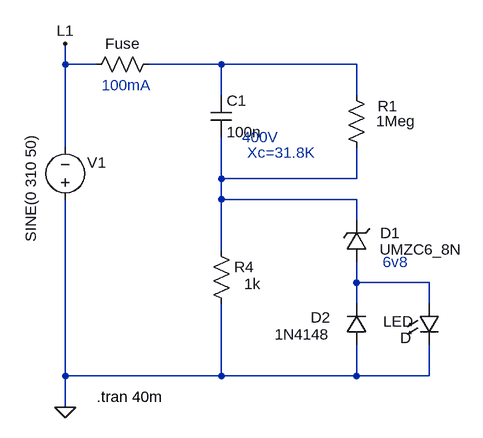
[diagram p0: schematic v2.0.asc]
v2.0.asc, the LTspice schematic file:
Version 4.1
SHEET 1 1084 836
WIRE -144 16 -144 -16
WIRE -96 16 -144 16
WIRE 96 16 -16 16
WIRE 304 16 96 16
WIRE 96 64 96 16
WIRE 304 64 304 16
WIRE -144 144 -144 16
WIRE 96 192 96 128
WIRE 304 192 304 144
WIRE 304 192 96 192
WIRE 96 224 96 192
WIRE 304 224 96 224
WIRE 304 256 304 224
WIRE 96 304 96 224
WIRE 304 352 304 320
WIRE 416 352 304 352
WIRE 304 384 304 352
WIRE 416 384 416 352
WIRE -144 496 -144 224
WIRE 96 496 96 384
WIRE 96 496 -144 496
WIRE 304 496 304 448
WIRE 304 496 96 496
WIRE 416 496 416 448
WIRE 416 496 304 496
WIRE -144 544 -144 496
FLAG -144 544 0
FLAG -144 -16 L1
SYMBOL voltage -144 240 R180
WINDOW 123 0 0 Left 0
WINDOW 39 0 0 Left 0
WINDOW 0 -63 73 Left 2
WINDOW 3 53 -50 VRight 2
SYMATTR InstName V1
SYMATTR Value SINE(0 310 50)
SYMBOL res 320 160 R180
WINDOW 0 -47 80 Left 2
WINDOW 3 -75 57 Left 2
SYMATTR InstName R1
SYMATTR Value 1Meg
SYMBOL res 80 288 R0
WINDOW 3 51 66 Left 2
SYMATTR Value 1k
SYMATTR InstName R4
SYMBOL zener 320 320 R180
WINDOW 0 -51 44 Left 2
WINDOW 3 -147 19 Left 2
SYMATTR InstName D1
SYMATTR Value UMZC6_8N
SYMBOL diode 320 448 R180
WINDOW 0 56 42 Left 2
WINDOW 3 57 16 Left 2
SYMATTR InstName D2
SYMATTR Value 1N4148
SYMBOL LED 400 384 R0
WINDOW 0 -55 28 Left 2
WINDOW 3 -29 53 Left 2
SYMATTR InstName LED
SYMBOL res 0 0 R90
WINDOW 0 0 56 VBottom 2
WINDOW 3 32 56 Invisible 2
SYMATTR InstName Fuse
SYMATTR Value 0
SYMBOL cap 80 64 R0
SYMATTR InstName C1
SYMATTR Value 100n
TEXT -96 528 Left 2 !.tran 40m
TEXT -88 48 Left 2 ;100mA
TEXT 136 152 Left 2 ;Xc=31.8K
TEXT 128 128 Left 2 ;400V
TEXT 344 320 Left 2 ;6v8

The netlist it stands for:
* v2.0.asc
V1 0 L1 SINE(0 310 50)
R1 N002 N001 1Meg
R4 N002 0 1k
D1 N003 N002 UMZC6_8N
D2 0 N003 1N4148
D§LED N003 0 D
R§Fuse N001 L1 0
C1 N001 N002 100n
.model D D
.lib standard.dio
.tran 40m
* 100mA
* Xc=31.8K
* 400V
* 6v8
.backanno
.end